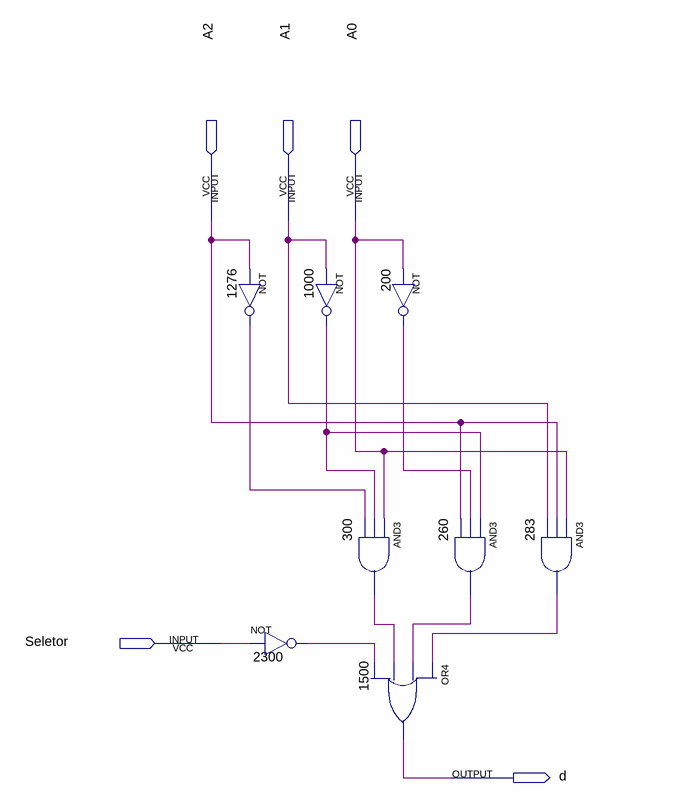
[diagram p0: schematic sheet]
// Quartus schematic segmento_d.bdf as structural Verilog: 8 symbols, 5 pins
module segmento_d (
  input  A2,
  input  A1,
  input  A0,
  input  Seletor,
  output d
);

  wire n200_out, n260_out, n283_out, n300_out, n1000_out, n1276_out, n2300_out;

  not u_1276 (n1276_out, A2);
  not u_2300 (n2300_out, Seletor);
  not u_1000 (n1000_out, A1);
  and u_300 (n300_out, A0, n1000_out, n1276_out);
  or u_1500 (d, n283_out, n260_out, n300_out, n2300_out);
  not u_200 (n200_out, A0);
  and u_260 (n260_out, n1000_out, n200_out, A2);
  and u_283 (n283_out, A0, A2, A1);
endmodule
